# EAGLE design arduinoCurrentSensor (EAGLE 9.4.2)
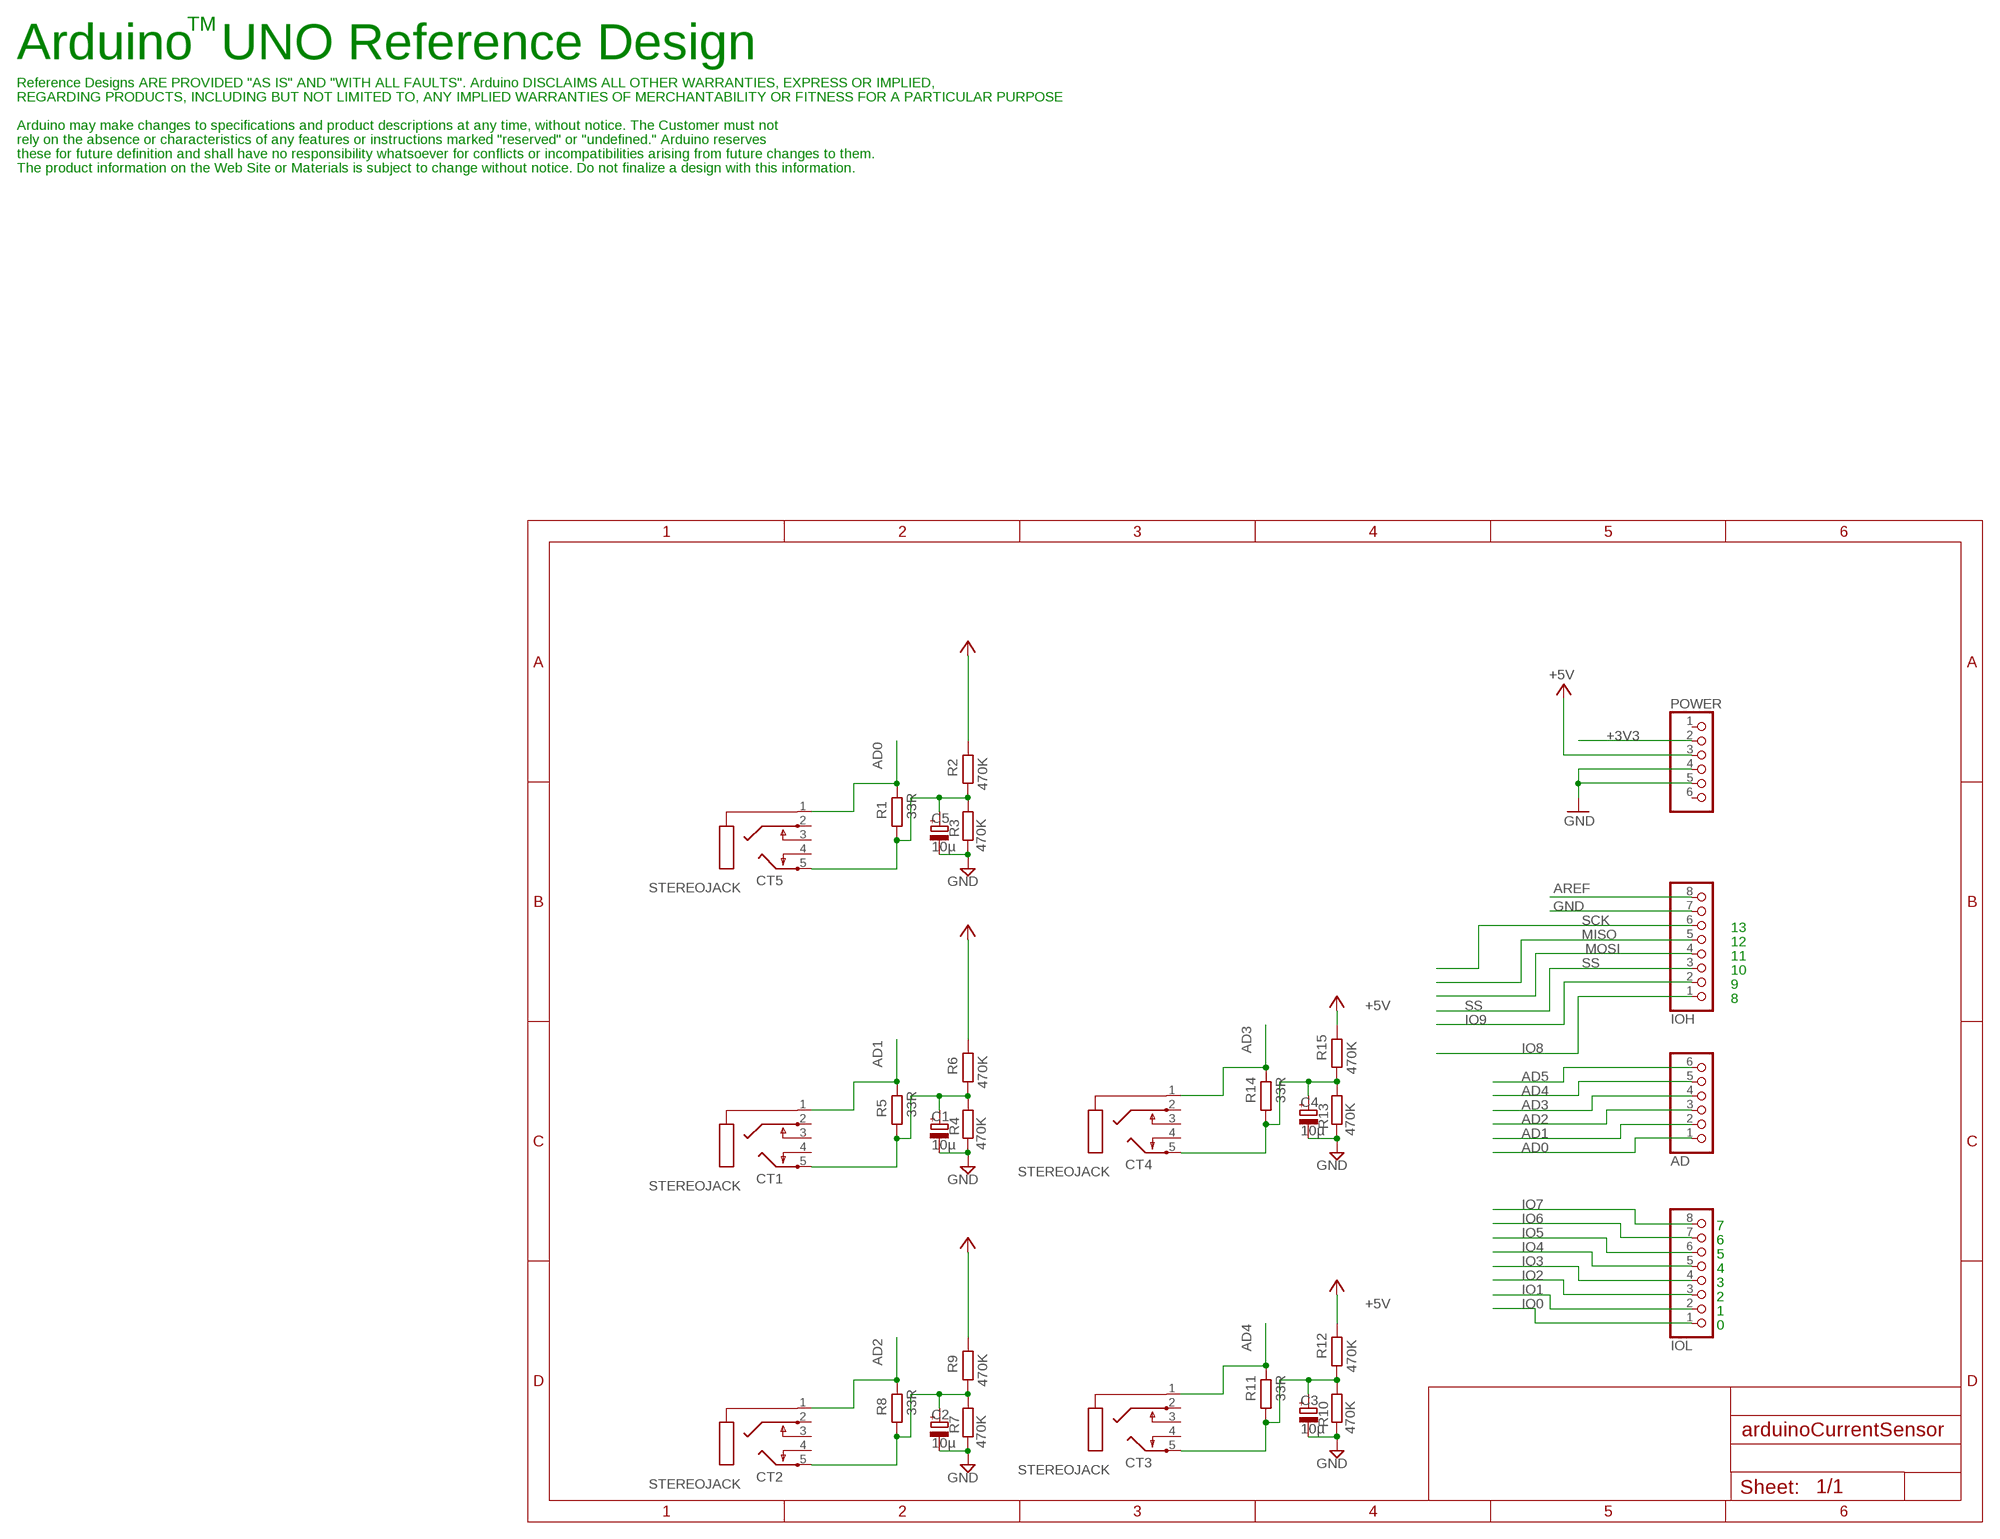
[diagram p0: schematic, sheet 1]

## Parts
AD  PINHD-1X6  [1X06]
C1  10µ  CPOL-EUE2-5  [E2-5]
C2  10µ  CPOL-EUE2-5  [E2-5]
C3  10µ  CPOL-EUE2-5  [E2-5]
C4  10µ  CPOL-EUE2-5  [E2-5]
C5  10µ  CPOL-EUE2-5  [E2-5]
CT1  STEREOJACK  [STX3100]
CT2  STEREOJACK  [STX3100]
CT3  STEREOJACK  [STX3100]
CT4  STEREOJACK  [STX3100]
CT5  STEREOJACK  [STX3100]
IOH  PINHD-1X8  [1X08]
IOL  PINHD-1X8  [1X08]
POWER  PINHD-1X6  [1X06]
R1  33R  R-EU_0204/7  [0204/7]
R2  470K  R-EU_0204/7  [0204/7]
R3  470K  R-EU_0204/7  [0204/7]
R4  470K  R-EU_0204/7  [0204/7]
R5  33R  R-EU_0204/7  [0204/7]
R6  470K  R-EU_0204/7  [0204/7]
R7  470K  R-EU_0204/7  [0204/7]
R8  33R  R-EU_0204/7  [0204/7]
R9  470K  R-EU_0204/7  [0204/7]
R10  470K  R-EU_0204/7  [0204/7]
R11  33R  R-EU_0204/7  [0204/7]
R12  470K  R-EU_0204/7  [0204/7]
R13  470K  R-EU_0204/7  [0204/7]
R14  33R  R-EU_0204/7  [0204/7]
R15  470K  R-EU_0204/7  [0204/7]

## Nets
+3V3: POWER.2
+5V: POWER.3 R2.2 R6.2 R9.2 R12.2 R15.2
AD0: AD.1 CT5.1 R1.2
AD1: AD.2 CT1.1 R5.2
AD2: AD.3 CT2.1 R8.2
AD3: AD.4 CT4.1 R14.2
AD4: AD.5 CT3.1 R11.2
AD5: AD.6
AREF: IOH.8
GND: C1.- C2.- C3.- C4.- C5.- IOH.7 POWER.4 POWER.5 R3.2 R4.2 R7.2 R10.2 R13.2
IO0: IOL.1
IO1: IOL.2
IO2: IOL.3
IO3: IOL.4
IO4: IOL.5
IO5: IOL.6
IO6: IOL.7
IO7: IOL.8
IO8: IOH.1
IO9: IOH.2
MISO: IOH.5
MOSI: IOH.4
N$1: C1.+ CT1.5 R4.1 R5.1 R6.1
N$2: C2.+ CT2.5 R7.1 R8.1 R9.1
N$3: C3.+ CT3.5 R10.1 R11.1 R12.1
N$4: C5.+ CT5.5 R1.1 R2.1 R3.1
N$5: C4.+ CT4.5 R13.1 R14.1 R15.1
SCK: IOH.6
SS: IOH.3
Unconnected: CT1.2 CT1.3 CT1.4 CT2.2 CT2.3 CT2.4 CT3.2 CT3.3 CT3.4 CT4.2 CT4.3 CT4.4 CT5.2 CT5.3 CT5.4 POWER.1 POWER.6

## Notes on the sheet
- TM
- Arduino  UNO Reference Design
- Reference Designs ARE PROVIDED "AS IS" AND "WITH ALL FAULTS". Arduino DISCLAIMS ALL OTHER WARRANTIES, EXPRESS OR IMPLIED,
- REGARDING PRODUCTS, INCLUDING BUT NOT LIMITED TO, ANY IMPLIED WARRANTIES OF MERCHANTABILITY OR FITNESS FOR A PARTICULAR PURPOSE
- Arduino may make changes to specifications and product descriptions at any time, without notice. The Customer must not
- rely on the absence or characteristics of any features or instructions marked "reserved" or "undefined." Arduino reserves
- these for future definition and shall have no responsibility whatsoever for conflicts or incompatibilities arising from future changes to them.
- The product information on the Web Site or Materials is subject to change without notice. Do not finalize a design with this information.
- 13
- 12
- 11
- 10
- 9
- 8
- 7
- 6
- 5
- 4
- 3
- 2
- 1
- 0

## Library data of the parts
AD POWER = pinhead:PINHD-1X6: PIN HEADER
C1-C5 = rcl:CPOL-EU: POLARIZED CAPACITOR, European symbol; SPICEPREFIX: C
CT1-CT5 = adafruit:STEREOJACK: MIC/HEADPHONE JACK Stereo jack with two switches. Kycon STX3100, CUI SJ1-3555NG and/or 4UCon 05544
IOH IOL = pinhead:PINHD-1X8: PIN HEADER
R1-R15 = rcl:R-EU_: RESISTOR, European symbol; SPICEPREFIX: R

## Net classes
0 default: width 0.203 mm, drill 0.6 mm, clearance 0.203 mm
1 power: width 0.305 mm, drill 0.6 mm, clearance 0.254 mm
2 gnd: width 0.254 mm, drill 0.6 mm, clearance 0.254 mm

## Board
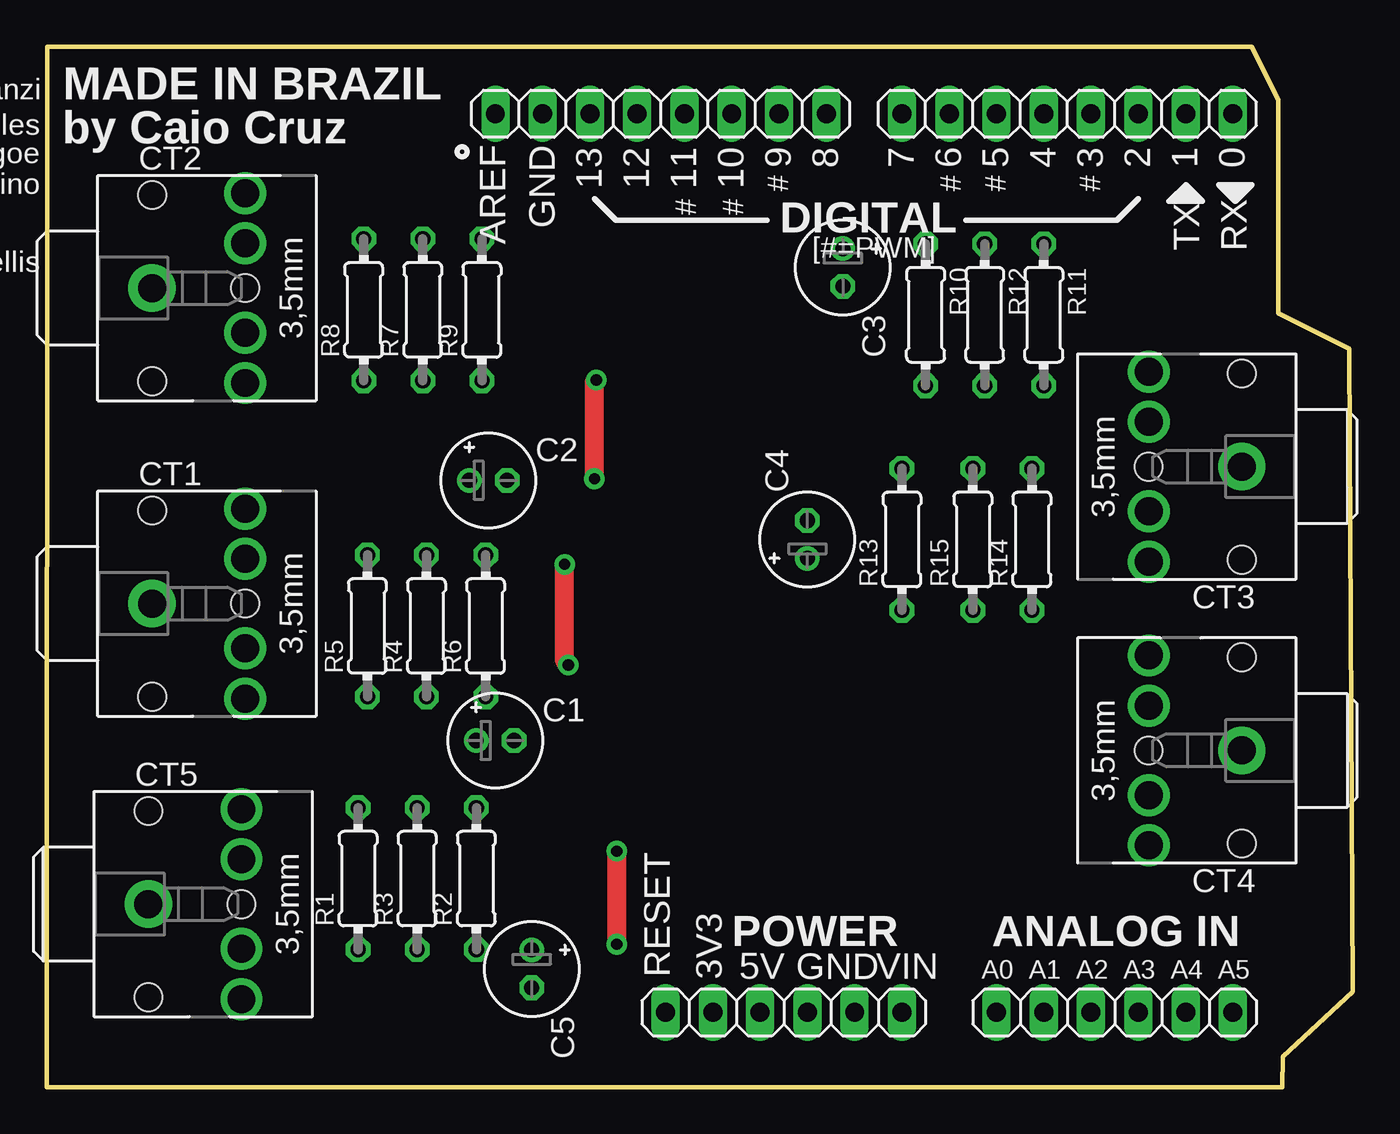
[diagram p1: board, top side]
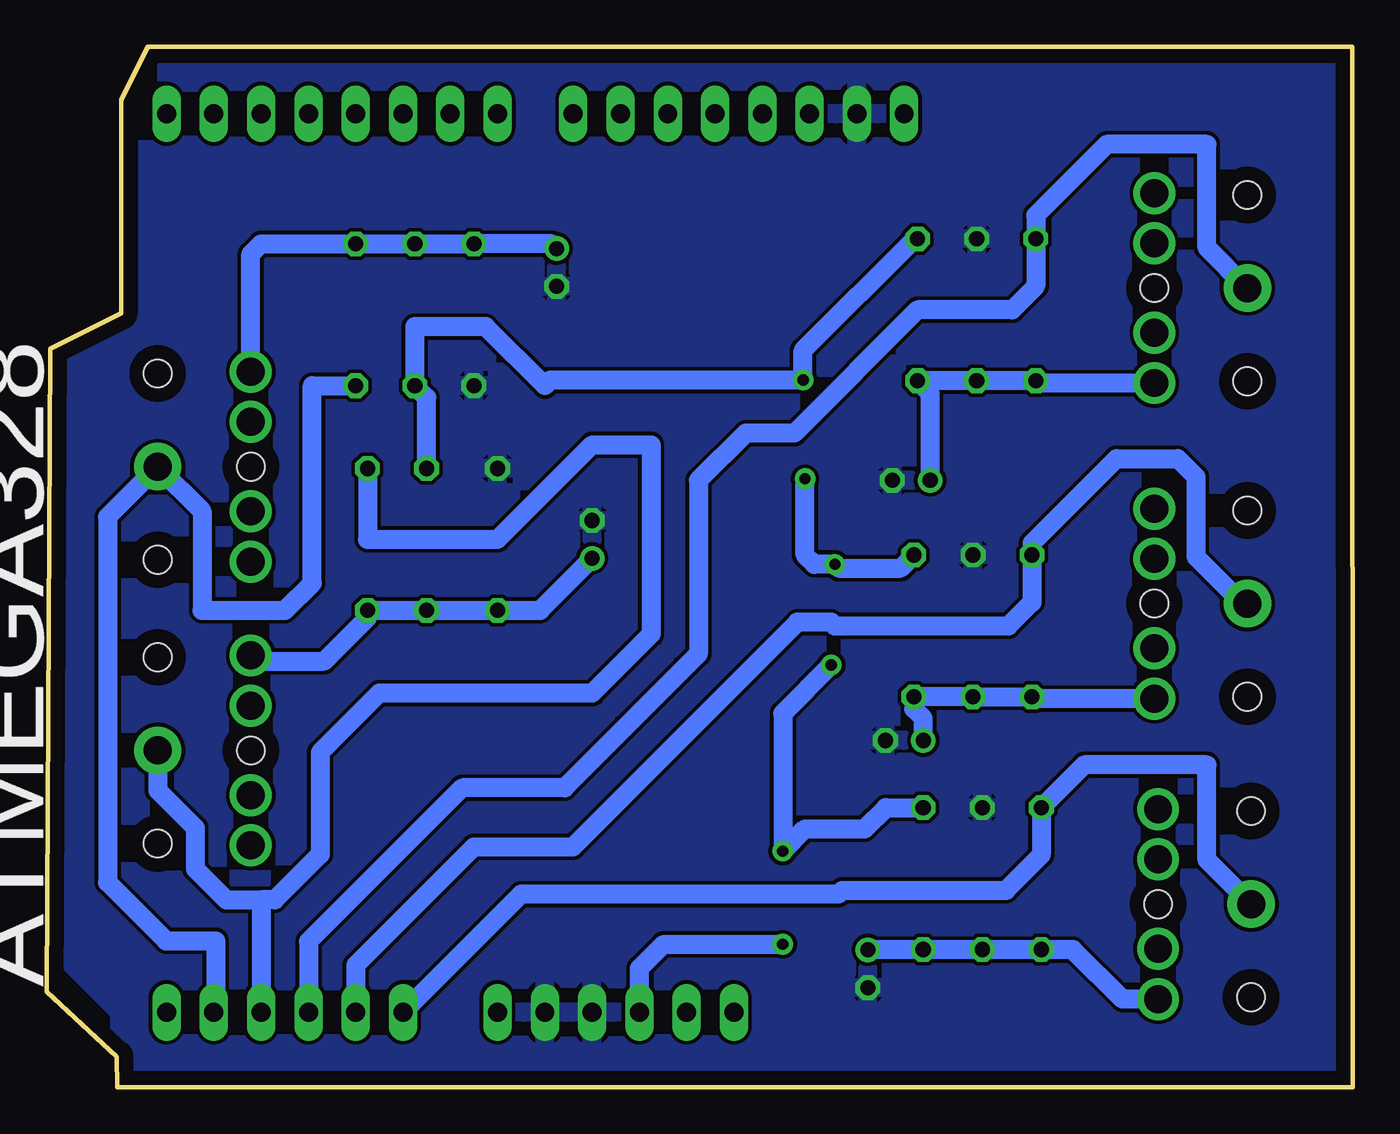
[diagram p2: board, bottom side, seen from below]

Size 70.19 x 55.88 mm. Coordinates in mm from the lower left corner, seen from the top.
Outline: 0.04,55.88 64.75,55.88 66.17,52.99 66.17,41.56 69.98,39.65 70.19,5.11 66.41,1.64 66.38,0 0,0 0.04,55.88
Copper layers (1*16): Top 0.035mm / dielectric 1.5mm / Bottom 0.035mm
Design rules "default *": minimum track width 8mil, minimum drill 12mil, track to track 6mil, track to pad 6mil, pad to pad 6mil, via to via 6mil, smd to smd 6mil, copper to edge 30mil, drill to drill 12mil, minimum pad ring 10mil, minimum via ring 10mil, stop-mask expansion 1mil, vias tented up to drill 0mil, thermal gap 10mil

### Footprints (pad centres in the part's own frame; a part is rotated, then mirrored left to right if it is on the bottom)
1X06 = drill 1.016 long: 1 -6.35,0; 2 -3.81,0; 3 -1.27,0; 4 1.27,0; 5 3.81,0; 6 6.35,0
E2-5 = drill 0.813 pad 1.27: + -1.016,0 | drill 0.813 pad 1.27 octagon: - 1.016,0
STX3100 = drill 1.5 pad 2.54: 1 2.7,-0.1 | drill 1.5: 2 7.7,5; 3 7.7,2.3; 4 7.7,-2.5; 5 7.7,-5.2 | hole 1.5: 2.7,4.9; 2.7,-5.1; 7.7,-0.1
1X08 = drill 1.016 long: 1 -8.89,0; 2 -6.35,0; 3 -3.81,0; 4 -1.27,0; 5 1.27,0; 6 3.81,0; 7 6.35,0; 8 8.89,0
0204/7 = drill 0.813 octagon: 1 -3.81,0; 2 3.81,0

### Placement (x,y rotation side)
AD  57.38,4.01 0 top
C1  24.1,18.61 0 top
C2  23.73,32.59 0 top
C3  42.78,44.02 270 top
C4  40.88,29.41 90 top
C5  26.07,6.35 270 top
CT1  2.97,26.06 0 top
CT2  2.97,43.01 0 top
CT3  66.91,33.22 180 top
CT4  66.91,17.98 180 top
CT5  2.77,9.93 0 top
IOH  33,52.27 180 top
IOL  54.84,52.27 180 top
POWER  39.6,4.01 0 top
R1  16.74,11.2 90 top
R2  23.09,11.2 90 top
R3  19.91,11.2 90 top
R4  20.41,24.77 90 top
R5  17.24,24.77 90 top
R6  23.59,24.77 90 top
R7  20.21,41.74 90 top
R8  17.04,41.74 90 top
R9  23.39,41.74 90 top
R10  47.22,41.48 270 top
R11  53.57,41.48 270 top
R12  50.4,41.48 270 top
R13  45.95,29.41 90 top
R14  52.94,29.41 90 top
R15  49.76,29.41 90 top

### Tracks (layer width: path | path; a pad name or v marks a point on that pad's centre or on a via)
+5V  (via drill 0.6)
  Top 1.016: v30.64,12.67 v30.64,7.67 | v28.04,22.67 27.84,22.87 v27.84,28.07 | v29.43,32.67 29.43,37.87 v29.54,37.97
  Bottom 1.016: POWER.3 38.33,6.37 37.03,7.67 v30.64,7.67 | R2.2 25.1,15.01 26.23,13.87 29.43,13.87 v30.64,12.67 30.64,20.07 v28.04,22.67 | R6.2 24.3,27.87 27.64,27.87 v27.84,28.07 28.93,28.07 29.43,28.57 v29.43,32.67 | R9.2 23.41,45.57 23.54,45.57 29.54,39.57 v29.54,37.97 43.11,37.97 43.41,37.66 46.59,40.84 50.4,40.84 R12.2 49.76,37.03 R15.2
AD0
  Bottom 1.016: CT5.1 7.85,12.21 7.85,17.31 14.44,17.31 R1.2 16.74,12.46 18.64,10.56 27.43,10.56 27.64,10.36 44.68,10.36 AD.1
AD1
  Bottom 1.016: AD.2 53.57,6.55 47.22,12.9 41.91,12.9 29.84,24.96 28.04,24.96 27.84,24.77 18.51,24.77 17.24,26.04 R5.2 17.24,29.21 12.7,33.75 9.42,33.75 8.44,32.77 8.44,28.47 5.93,25.96 CT1.1
AD2
  Bottom 1.016: CT2.1 7.85,45.09 7.85,50.63 13.23,50.63 17.04,46.82 R8.2 17.04,43.01 18.31,41.74 23.39,41.74 30,35.12 32.62,35.12 35.16,32.59 35.16,23.26 42.34,16.07 47.86,16.07 56.11,7.82 AD.3
AD3
  Bottom 1.016: R14.2 52.94,29.41 45.95,29.41 40.88,34.49 37.7,34.49 37.7,24.33 40.88,21.15 52.3,21.15 55.48,17.98 55.48,12.5 57.92,10.06 58.65,10.06 | 58.65,10.06 AD.4 | CT4.1 64.21,15.94 62.19,13.92 62.19,11.72 60.53,10.06 58.65,10.06
AD4
  Bottom 1.016: R11.2 55.91,37.66 55.91,27.07 57.38,25.6 61.83,25.6 61.83,30.94 CT3.1 66.91,30.62 66.91,11 63.77,7.85 61.09,7.85 61.09,4.11 AD.5
GND
  pour Bottom: 0,56.08 63.73,56.08 66.27,53.54 66.27,42.11 70.08,38.3 70.08,7.82 66.27,4.01 66.27,-0.1 0,-0.1
N$1
  Bottom 1.016: CT1.5 17.15,20.86 R5.1 R4.1 R6.1 23.59,20.31 23.08,19.8 C1.+
N$2
  Bottom 1.016: CT2.5 16.92,37.81 R8.1 R7.1 R9.1 22.71,37.25 C2.+
N$3
  Bottom 1.016: CT3.5 59.21,44.73 58.65,45.28 R11.1 R12.1 R10.1 43.03,45.28 C3.+
N$4
  Bottom 1.016: CT5.5 12.38,4.72 15.04,7.38 R1.1 R3.1 R2.1 26.02,7.38 C5.+
N$5
  Bottom 1.016: CT4.5 58.91,22.88 55.26,22.88 52.94,25.2 R14.1 R15.1 R13.1 43.67,25.6 C4.+

### Text on the board
tPlace: MADE IN BRAZIL | by Caio Cruz | 13 | 12 | 11 | 10 | 9 | 8 | 7 | 6 | 5 | 4 | 3 | 2 | 1 | 0
tNames: M.Banzi | D.Cuartielles | T.Igoe | AREF | GND | G.Martino | # | # | # | # | # | # | DIGITAL | D.Mellis | [#=PWM] | TX | RX | ANALOG IN | RESET | 3V3 | 5V | GND | VIN | A0 | A1 | A2 | A3 | A4 | A5
bNames: ATMEGA328
ReferenceLC: L
tDocu: TM | Arduino UNO Reference Design | ARDUINO is a registered trademark by Arduino LLC, Boston, MA, USA | Reference Designs ARE PROVIDED "AS IS" AND "WITH ALL FAULTS". Arduino DISCLAIMS ALL OTHER WARRANTIES, EXPRESS OR IMPLIED, | REGARDING PRODUCTS, INCLUDING BUT NOT LIMITED TO, ANY IMPLIED WARRANTIES OF MERCHANTABILITY OR FITNESS FOR A PARTICULAR PURPOSE | Arduino may make changes to specifications and product descriptions at any time, without notice. The Customer must not | rely on the absence or characteristics of any features or instructions marked "reserved" or "undefined." Arduino reserves | these for future definition and shall have no responsibility whatsoever for conflicts or incompatibilities arising from future changes to them. | The product information on the Web Site or Materials is subject to change without notice. Do not finalize a design with this information.
214bmp: D:/SmartProjects/Snc/a4_bn_logo2.bmp